# Altium schematic sheet lowpass-adc-input.SchDoc: ADC Input Lowpass
size A4; DrawnBy: Dylan Vogel; Organization: UTAT SS; DocumentNumber: 5; Revision: 2; SheetNumber: 5; SheetTotal: 13
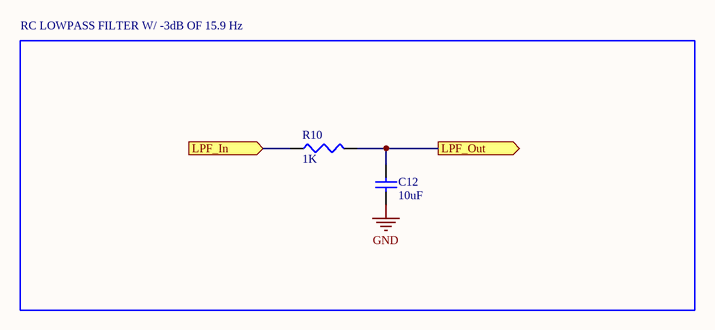
[diagram p0: lowpass-adc-input.SchDoc]

## Parts
C12  10uF  [C1206]
R10  1K  [J1-0603]

## Blocks framed on the sheet
RC LOWPASS FILTER W/ -3dB OF 15.9 Hz: C12 R10

## Ports
LPF_In (in), LPF_Out (out)

## Nets
GND: C12.1
LPF_In: R10.1 ; port LPF_In
LPF_Out: C12.2 R10.2 ; port LPF_Out

## Library data of the parts
C12 = Cap Semi: Capacitor (Semiconductor SIM Model); Published: 8-Jun-2000; LatestRevisionDate: 29-May-2009; LatestRevisionNote: IPC-7351 Footprint Added.; PackageReference: C1206; Publisher: Altium Limited; PackageDescription: Chip Capacitor; Value: 10uF
R10 = Res3: Resistor; Published: 8-Jun-2000; LatestRevisionDate: 29-May-2009; LatestRevisionNote: IPC-7351 Footprint Added.; PackageReference: J1-0603; Publisher: Altium Limited; PackageDescription: Chip Resistor; Value: 1K